# Altium schematic sheet Micron-6.SchDoc: Ультра-Микрон
size A4; Date: 18.11.2013; Author: Andrey Bykanov; CompanyName: http://микрон.net; Engineer: Andrey Bykanov; Address1: Дозиметр Ультра-Микрон; Address2: (с) Быканов Андрей; Address3: Тула, 2014-15г.; Address4: shodan@микрон.net; Revision: 4.06 lite; PageSetup: Record=PageOptions|CenterHorizontal=False|CenterVertical=False|PrintScale=0.98|XCorrection=1.00|YCorrection=1.00|PrintKind=1|BorderSize=5000000|LeftOffset=0|BottomOffset=0|Orientation=2|PaperLength=1000|PaperWidth=1000|Scale=100|PaperSource=7|PrintQuality=-3|MediaType=1|DitherType=10|PrintScaleMode=0|PaperKind=A4|PaperIndex=9
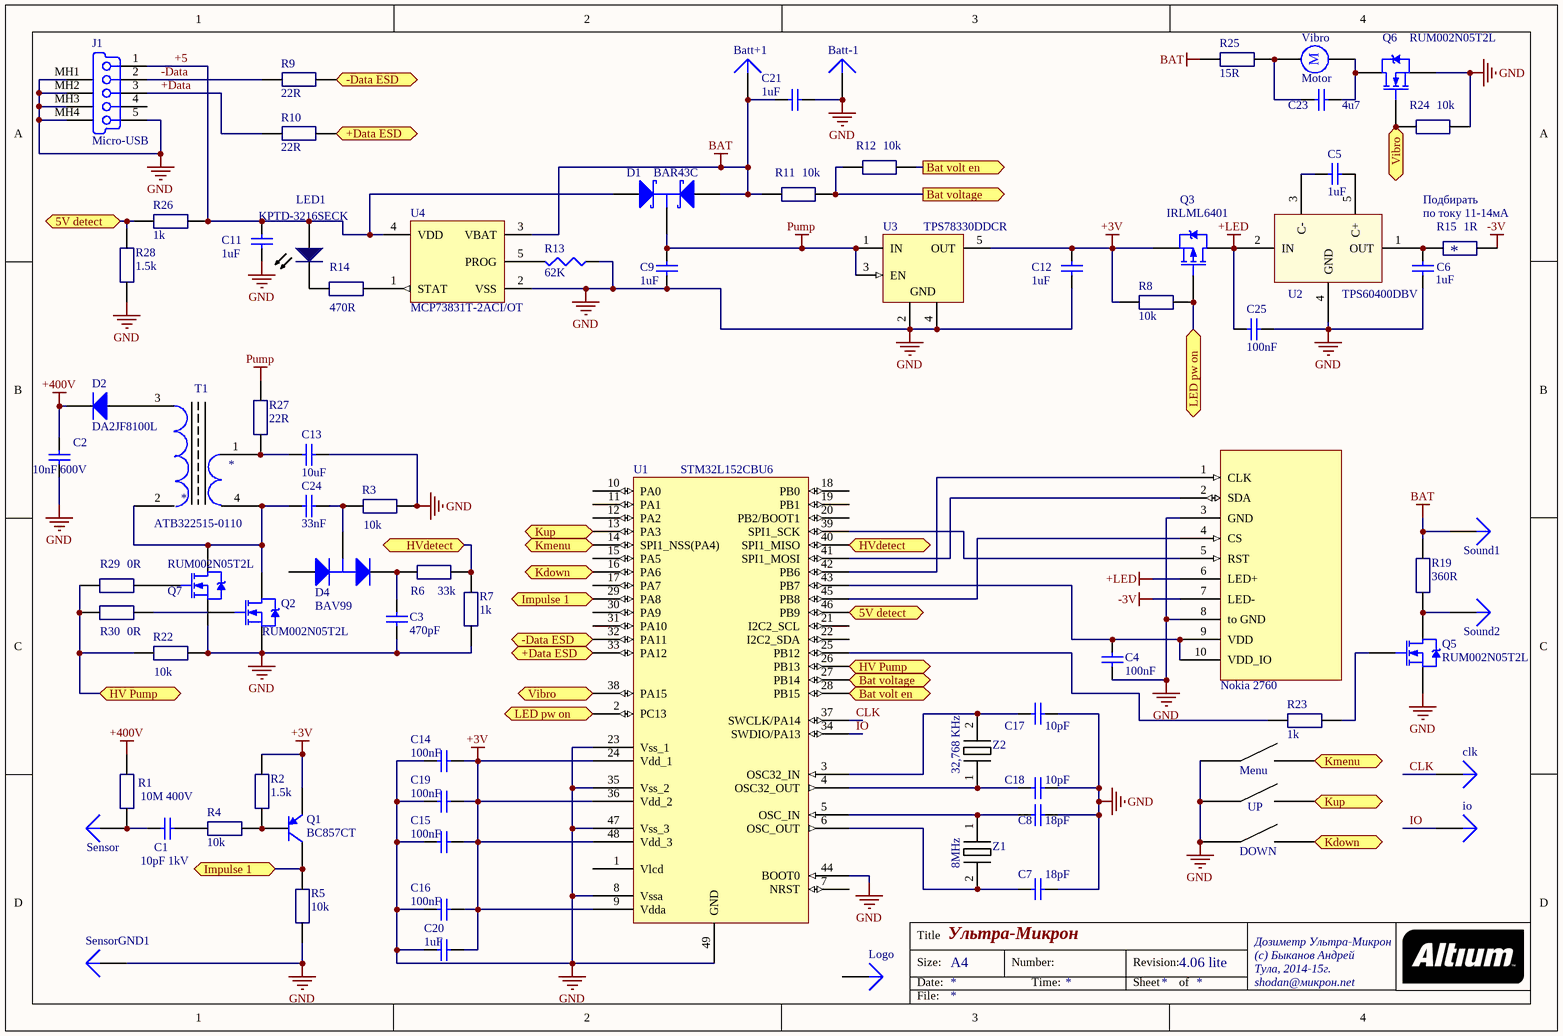
[diagram p0: Micron-6.SchDoc]

## Parts
Batt+1  (no value)  [Sensor contact]
Batt-1  (no value)  [Sensor contact]
C1  10pF 1kV  [0805 sw-2012 std]
C2  10nF 600V  [C1206]
C3  470pF  [1608[0603]]
C4  100nF  [0402 AVX]
C5  1uF  [0402 AVX]
C6  1uF  [0402 AVX]
C7  18pF  [0402 AVX]
C8  18pF  [0402 AVX]
C9  1uF  [1608[0603]]
C11  1uF  [0402 AVX]
C12  1uF  [1608[0603]]
C13  10uF  [C1206]
C14  100nF  [0402 AVX]
C15  100nF  [0402 AVX]
C16  100nF  [0402 AVX]
C17  10pF  [0402 AVX]
C18  10pF  [0402 AVX]
C19  100nF  [0402 AVX]
C20  1uF  [0402 AVX]
C21  1uF  [0402 AVX]
C23  4u7  [C1206]
C24  33nF  [1608[0603]]
C25  100nF  [0402 AVX]
clk  (no value)  [Sensor contact]
D1  BAR43C  [SOT23_N]
D2  DA2JF8100L  [DA2JF8100L]
D4  BAV99  [SOT23-3]
Display1  Nokia 2760  [DF23C-10DS-0.5V]
io  (no value)  [Sensor contact]
J1  Micro-USB  [47346-0001]
KEY1  Menu  [IT-1187-160GM-G]
KEY2  UP  [IT-1187-160GM-G]
KEY3  DOWN  [IT-1187-160GM-G]
LED1  KPTD-3216SECK  [KPTD-3216SECK]
Logo  (no value)  [Logo Micron]
Q1  BC857CT  [SOT416_N]
Q2  RUM002N05T2L  [PMR400UN]
Q3  IRLML6401  [Micro3_N]
Q5  RUM002N05T2L  [PMR400UN]
Q6  RUM002N05T2L  [PMR400UN]
Q7  RUM002N05T2L  [PMR400UN]
R1  10M 400V  [0805 sw-2012 std]
R2  1.5k  [1608[0603]]
R3  10k  [1608[0603]]
R4  10k  [1608[0603]]
R5  10k  [1608[0603]]
R6  33k  [1608[0603]]
R7  1k  [1608[0603]]
R8  10k  [1608[0603]]
R9  22R  [1608[0603]]
R10  22R  [1608[0603]]
R11  10k  [1608[0603]]
R12  10k  [1608[0603]]
R13  62K  [J1-0603]
R14  470R  [1608[0603]]
R15  1R  [1608[0603]]
R19  360R  [Resistor]
R22  10k  [1608[0603]]
R23  1k  [1608[0603]]
R24  10k  [1608[0603]]
R25  15R  [1608[0603]]
R26  1k  [1608[0603]]
R27  22R  [1608[0603]]
R28  1.5k  [1608[0603]]
R29  0R  [1608[0603]]
R30  0R  [1608[0603]]
Sensor  (no value)  [Sensor contact]
SensorGND1  (no value)  [Sensor contact]
Sound1  (no value)  [Sensor contact]
Sound2  (no value)  [Sensor contact]
T1  ATB322515-0110  [ATB322515-0110]
U1  STM32L152CBU6  [UFQFPN48_M]
U2  TPS60400DBV  [SOT-23-OT5_M]
U3  TPS78330DDCR  [TI-DDC5_N]
U4  MCP73831T-2ACI/OT  [SOT-23-OT5_N]
Vibro  Motor  [Vibro 4hobby]
Z1  8MHz  [8MHZ]
Z2  32,768 KHz  [ABS10]

## Ports
5V detect, +Data ESD, +Data ESD (bidir), -Data ESD, -Data ESD (bidir), Bat volt en (out), Bat voltage (out), HV Pump, HVdetect, Impulse 1, Kdown, Kmenu, Kup, LED pw on, Vibro

## Nets
+3V: C12.2 C14.1 C15.1 C16.1 C19.1 C20.1 Q1.2(E) Q3.2(S) R2.1(A) R8.2 U1.9(Vdda) U1.24(Vdd_1) U1.36(Vdd_2) U1.48(Vdd_3) U3.5(OUT)
+400V: C2.2 D2.2(K) R1.2
+LED: C25.1 Display1.6(LED+) Q3.3(D) U2.2(IN)
-3V: Display1.7(LED-) R15.1(A)
BAT: Batt+1.1 C21.2 D1.2(A2) R11.2 R19.1(A) R25.1(A) Sound1.1 U4.3(VBAT)
GND: Batt-1.1 C2.1 C3.2 C4.2 C6.1 C7.1 C8.2 C9.1 C11.1 C12.1 C13.1 C14.2 C15.2 C16.2 C17.1 C18.1 C19.2 C20.2 C21.1 C25.2 Display1.3(GND) Display1.8(to_GND) J1.5(GND) J1.MH1(Tab) J1.MH2(Tab) J1.MH3(Tab) J1.MH4(Tab) KEY1.3 KEY2.3 KEY3.3 Q2.2(S) Q5.2(S) Q6.2(S) Q7.2(S) R3.1(A) R5.2 R7.1(A) R13.1 R22.1(A) R24.1(A) R28.2 SensorGND1.1 U1.8(Vssa) U1.23(Vss_1) U1.35(Vss_2) U1.44(BOOT0) U1.47(Vss_3) U1.49(GND) U2.4(GND) U3.2(GND) U3.4(GND) U4.2(VSS)
Pump: C9.2 D1.3(K) R27.1(A) U3.1(IN) U3.3(EN)
5V detect: R26.1(A) R28.1(A) U1.46(PB9) ; port 5V detect
+5: C11.2 D1.1(A1) J1.1(V_BUS_(5V)) LED1.2 R26.2 U4.4(VDD)
+Data: J1.3(D+) R10.2
+Data ESD: R10.1(A) U1.33(PA12) ; port +Data ESD
-Data: J1.2(D-) R9.2
-Data ESD: R9.1(A) U1.32(PA11) ; port -Data ESD
Bat volt en: R12.1(A) U1.28(PB15) ; port Bat volt en
Bat voltage: R11.1(A) R12.2 U1.27(PB14) ; port Bat voltage
CLK: clk.1 U1.37(SWCLK/PA14)
HV Pump: R22.2 R29.2 R30.2 U1.26(PB13) ; port HV Pump
HVdetect: R6.2 R7.2 U1.40(SPI1_MISO) ; port HVdetect
Impulse 1: Q1.3(C) R5.1(A) U1.29(PA8) ; port Impulse 1
IO: io.1 U1.34(SWDIO/PA13)
Kdown: KEY3.4 U1.16(PA6) ; port Kdown
Kmenu: KEY1.4 U1.14(SPI1_NSS(PA4)) ; port Kmenu
Kup: KEY2.4 U1.13(PA3) ; port Kup
LED pw on: Q3.1(G) R8.1(A) U1.2(PC13) ; port LED pw on
Vibro: Q6.1(G) R24.2 U1.38(PA15) ; port Vibro
NetC1_1: C1.1 R4.1(A)
NetC1_2: C1.2 R1.1(A) Sensor.1
NetC3_1: C3.1 D4.2(K) R6.1(A)
NetC4_1: C4.1 Display1.9(VDD) Display1.10(VDD_IO) U1.43(PB7)
NetC5_1: C5.1 U2.5(C+)
NetC5_2: C5.2 U2.3(C-)
NetC6_2: C6.2 R15.2 U2.1(OUT)
NetC7_2: C7.2 U1.6(OSC_OUT) Z1.2
NetC8_1: C8.1 U1.5(OSC_IN) Z1.1
NetC13_2: C13.2 R27.2 T1.1
NetC17_2: C17.2 U1.3(OSC32_IN) Z2.2
NetC18_2: C18.2 U1.4(OSC32_OUT) Z2.1
NetC23_1: C23.1 Q6.3(D) Vibro.2
NetC23_2: C23.2 R25.2 Vibro.1
NetC24_1: C24.1 Q2.3(D) Q7.3(D) T1.2 T1.4
NetC24_2: C24.2 D4.3(C) R3.2
NetD2_1: D2.1(A) T1.3
NetDisplay1_1: Display1.1(CLK) U1.42(PB6)
NetDisplay1_2: Display1.2(SDA) U1.41(SPI1_MOSI)
NetDisplay1_4: Display1.4(CS) U1.45(PB8)
NetDisplay1_5: Display1.5(RST) U1.39(SPI1_SCK)
NetLED1_1: LED1.1 R14.2
NetQ1_1: Q1.1(B) R2.2 R4.2
NetQ2_1: Q2.1(G) R30.1(A)
NetQ5_1: Q5.1(G) R23.1(A)
NetQ5_3: Q5.3(D) R19.2 Sound2.1
NetQ7_1: Q7.1(G) R29.1(A)
NetR13_2: R13.2 U4.5(PROG)
NetR14_1: R14.1(A) U4.1(STAT)
NetR23_2: R23.2 U1.25(PB12)

Not connected (* = marked no-connect by the designer): D4 1(A); J1 4(NC); Logo 1; U1 1(Vlcd) 7(NRST) 10(PA0) 11(PA1) 12(PA2) 15(PA5) 17(PA7) 18(PB0) 19(PB1) 20(PB2/BOOT1) 21(I2C2_SCL) 22(I2C2_SDA) 30(PA9) 31(PA10)

## Notes on the sheet
- Подбирать
- по току 11-14мА
- (near R15) *
- Title
- Size:
- Date:
- A4
- Number:
- Time:
- Revision:
- Sheet
- of
- File:
- (in symbol Motor) M

## Library data of the parts
Batt+1 = Plug: Order: EEMB LP401230; LatestRevisionDate: 17-Jul-2002; LatestRevisionNote: Re-released for DXP Platform.; Publisher: Altium Limited
Batt-1 clk io Logo SensorGND1 Sound2 = Plug: LatestRevisionDate: 17-Jul-2002; LatestRevisionNote: Re-released for DXP Platform.; Publisher: Altium Limited
C1 = Cap Semi: Capacitor (Semiconductor SIM Model); Order: VJ0805A100JXGAT5Z; Published: 8-Jun-2000; LatestRevisionDate: 29-May-2009; LatestRevisionNote: IPC-7351 Footprint Added.; PackageReference: C0805; Publisher: Altium Limited; PackageDescription: Chip Capacitor; Value: 10pF 1kV
C2 = Cap Semi: Capacitor (Semiconductor SIM Model); Order: 1206CC103KAT1A; Published: 8-Jun-2000; LatestRevisionDate: 29-May-2009; LatestRevisionNote: IPC-7351 Footprint Added.; PackageReference: C1206; Publisher: Altium Limited; PackageDescription: Chip Capacitor; Value: 10nF 600V
C3 = Cap Semi: Capacitor (Semiconductor SIM Model); Order: CC0603JRNPO9BN471; Value: 470pF
C4 C14-C16 C19 C25 = Cap Semi: Capacitor (Semiconductor SIM Model); Order: 0402ZD104KAT2A; Published: 8-Jun-2000; LatestRevisionDate: 29-May-2009; LatestRevisionNote: IPC-7351 Footprint Added.; PackageReference: C1206; Publisher: Altium Limited; PackageDescription: Chip Capacitor; Value: 100nF
C5 C6 C11 C20 = Cap Semi: Capacitor (Semiconductor SIM Model); Order: CC0402KRX5R5BB105; Avail: 1; Published: 8-Jun-2000; LatestRevisionDate: 29-May-2009; LatestRevisionNote: IPC-7351 Footprint Added.; PackageReference: C1206; Publisher: Altium Limited; PackageDescription: Chip Capacitor; Value: 1uF
C7 C8 = Cap Semi: Capacitor (Semiconductor SIM Model); Order: GRM1555C1H180JZ01D; Published: 8-Jun-2000; LatestRevisionDate: 29-May-2009; LatestRevisionNote: IPC-7351 Footprint Added.; PackageReference: C1206; Publisher: Altium Limited; PackageDescription: Chip Capacitor; Value: 18pF
C9 = CAPACITOR: Capacitor (Semiconductor SIM Model); Order: CC0603KRX5R7BB105; Avail: 1; Published: 8-Jun-2000; LatestRevisionDate: 29-May-2009; LatestRevisionNote: IPC-7351 Footprint Added.; PackageReference: C1206; Publisher: Altium Limited; PackageDescription: Chip Capacitor; Value: 1uF
C12 = CAPACITOR: Capacitor (Semiconductor SIM Model); Order: CC0603KRX5R7BB105; Published: 8-Jun-2000; LatestRevisionDate: 29-May-2009; LatestRevisionNote: IPC-7351 Footprint Added.; PackageReference: C1206; Publisher: Altium Limited; PackageDescription: Chip Capacitor; Value: 1uF
C13 = Cap Semi: Capacitor (Semiconductor SIM Model); Order: GRM31CR61A106KA01L; Published: 8-Jun-2000; LatestRevisionDate: 29-May-2009; LatestRevisionNote: IPC-7351 Footprint Added.; PackageReference: C1206; Publisher: Altium Limited; PackageDescription: Chip Capacitor; Value: 10uF
C17 C18 = Cap Semi: Capacitor (Semiconductor SIM Model); Order: GRM1555C1H100JA01D; Published: 8-Jun-2000; LatestRevisionDate: 29-May-2009; LatestRevisionNote: IPC-7351 Footprint Added.; PackageReference: C1206; Publisher: Altium Limited; PackageDescription: Chip Capacitor; Value: 10pF
C21 = Cap Semi: Capacitor (Semiconductor SIM Model); Order: CC0402KRX5R5BB105; Published: 8-Jun-2000; LatestRevisionDate: 29-May-2009; LatestRevisionNote: IPC-7351 Footprint Added.; PackageReference: C1206; Publisher: Altium Limited; PackageDescription: Chip Capacitor; Value: 1uF
C23 = CAPACITOR: Capacitor (Semiconductor SIM Model); Order: CC1206KKX7R8BB475; Avail: 1; Published: 8-Jun-2000; LatestRevisionDate: 29-May-2009; LatestRevisionNote: IPC-7351 Footprint Added.; PackageReference: C1206; Publisher: Altium Limited; PackageDescription: Chip Capacitor; Value: 4u7
C24 = Cap Semi: Capacitor (Semiconductor SIM Model); Order: 06035C333JAT2A; Value: 33nF
D1 = BAT54C: Schottky Barrier Double Diode; Published: 17-Sep-2003; LatestRevisionDate: 12-Dec-2006; LatestRevisionNote: IPC-7351 Footprint Added.; DatasheetVersion: 4-Mar-2002; PackageVersion: May-1999; PackageReference: SOT23; Publisher: Altium Limited; PackageDescription: 3-Pin SOT-23 Package 0.95 mm Pitch, 2.3 mm Lead Span; ComponentLink1Description: Manufacturer Link; ComponentLink1URL: http://www.semiconductors.philips.com/; ComponentLink2Description: Datasheet; ComponentLink2URL: http://www.semiconductors.philips.com/acrobat/datasheets/BAT54_SERIES_4.pdf; Order: BAR43C
D2 = Diode: Default Diode; Published: 8-Jun-2000; LatestRevisionDate: 17-Jul-2002; LatestRevisionNote: Re-released for DXP Platform.; PackageVersion: Sep-1996; PackageReference: SMC; Publisher: Altium Limited; PackageDescription: DO-214-AB/SMC; 2 C-Bend Leads; Body 7.9 x 5.9 mm, inc. leads (LxW); Code_JEDEC: DO-214-AB; Order: DA2JF8100L; Value: DA2JF8100L
D4 = BAV99: Silicon Switching Diode Array for High-Speed Switching; Published: 21-Mar-2003; DatasheetDocument: Oct-1999; PackageDocument: Sep-2001; PackageReference: SOT-23; Publisher: Altium Limited; ComponentLink1Description: Manufacturer Link; ComponentLink1URL: http://www.infineon.com/; ComponentLink2Description: Datasheet; ComponentLink2URL: http://www.infineon.com/upload/Document/cmc_upload/documents/080/631/bav99series_1.pdf; Value: BAV99; Order: BAV99
Display1 = Nokia 2760: Order: Nokia 2760 ext + Socket Hirose DF23C-10DS-0.5V
J1 = 0481900001: USB On-The-Go (OTG) Mini-B Receptacle, Right Angle, SMT, 0.80mm (.031") Pitch, Solder Tabs with Back Cover, Recessed Type; Order: Molex 47346-0001
KEY1-KEY3 = Micro_key_smd: Order: IT-1187-160GM-G
LED1 = KPTD-3216SECK: Avail: 1; Order: KPTD-3216SECK
Q1 = BC857CT: PNP General-purpose Transistor; Published: 17-Sep-2003; LatestRevisionDate: 12-Dec-2006; LatestRevisionNote: IPC-7351 Footprint Added.; DatasheetVersion: 15-Nov-2000; PackageVersion: Apr-1999; PackageReference: SOT416; Publisher: Altium Limited; PackageDescription: 3-Pin SOT-416 Package 0.50 mm Pitch, 1.6 mm Lead Span; Code_JEITA: SC-75; ComponentLink1Description: Manufacturer Link; ComponentLink1URL: http://www.semiconductors.philips.com/; ComponentLink2Description: Datasheet; ComponentLink2URL: http://www.semiconductors.philips.com/acrobat/datasheets/BC856T_857T_SERIES_3.pdf; value: BC857CT; order: BC857CT
Q2 Q5-Q7 = IRLML2402: HEXFET Power MOSFET; Published: 8-Jun-2000; LatestRevisionDate: 20-Nov-2009; LatestRevisionNote: IPC-7351 Footprint Added.; DatasheetVersion: Aug-1997; PackageReference: SOT-23; Publisher: Altium Limited; PackageDescription: 3-Pin SOT-23 Package 0.95 mm Pitch, 2.3 mm Lead Span; ComponentLink1Description: Manufacturer Link; ComponentLink1URL: http://www.irf.com/; ComponentLink2Description: Datasheet; ComponentLink2URL: http://www.irf.com/product-info/datasheets/data/irlml2402.pdf; Order: RUM002N05T2L; Value: RUM002N05T2L
Q3 = IRLML6401: HEXFET Power MOSFET; Published: 17-Sep-2003; DatasheetVersion: 2-Jul-2001; PackageVersion: Jul-2001; PackageReference: Micro3; Publisher: Altium Limited; PackageDescription: 3-Pin SOT-23 Package 0.95 mm Pitch, 2.3 mm Lead Span; ComponentLink1Description: Manufacturer Link; ComponentLink1URL: http://www.irf.com/; ComponentLink2Description: Datasheet; ComponentLink2URL: http://www.irf.com/product-info/datasheets/data/IRLML6401.pdf; Order: IRLML6401; Value: IRLML6401
R1 = Resistor 0805: Model: RCV080510M0FKEA; Order: RCV080510M0FKEA; Value: 10M 400V
R2 R28 = Resistor 0805: Order: RC0603FR-071K5L; Value: 1.5k
R3 R5 R8 R22 R24 = Resistor 0805: Order: RC0603FR-1010KL; Value: 10k
R4 R11 R12 = Resistor 0805: Order: RC0603FR-1010KL; Avail: 1; Value: 10k
R6 = Resistor 0805: Order: RC0603FR-0733KL; Value: 33k
R7 R23 = Resistor 0805: Order: RC0603FR-101KL; Value: 1k
R9 R10 R27 = Resistor 0805: Order: CR0603-JW-220GLF; Avail: 20; Value: 22R
R13 = Res3: Resistor; Order: RC0603JR-0762KL; Avail: 1; Published: 8-Jun-2000; LatestRevisionDate: 29-May-2009; LatestRevisionNote: IPC-7351 Footprint Added.; PackageReference: J1-0603; Publisher: Altium Limited; PackageDescription: Chip Resistor; Value: 62K
R14 = Resistor 0805: Order: RC0603JR-07470RL; Avail: 1; Value: 470R
R15 = Resistor 0805: Order: RC0603FR-071RL; Avail: 20; Value: 1R
R19 = Resistor 0805: Order: RC0805FR-07360RL; Value: 360R
R25 = Resistor 0805: Order: RC0805FR-0715RL; Value: 15R
R26 = Resistor 0805: Order: RC0603FR-101KL; Avail: 1; Value: 1k
R29 R30 = Resistor 0805: Order: RC0603JR-100RL; Value: 0R
Sensor = Plug: Order: SBM-10; LatestRevisionDate: 17-Jul-2002; LatestRevisionNote: Re-released for DXP Platform.; Publisher: Altium Limited
Sound1 = Plug: Order: 7BB-12-9; LatestRevisionDate: 17-Jul-2002; LatestRevisionNote: Re-released for DXP Platform.; Publisher: Altium Limited
T1 = ATB322515-0110: Value: FlayBack trans.; Order: ATB322515-0110
U2 = TPS60400: Order: TPS60400DBV
U3 = TPS78330DDCR: Single Output LDO, 150 mA, Fixed 3 V Output, 2.2 to 5.5 V Input, with Ultra-Low IQ, 5-pin SOT (DDC), -40 to 105 degC, Green (RoHS & no Sb/Br); Manufacturer: Texas Instruments; Accuracy(%): 3; Iout(Max)(A): 0.15; Iq(Typ)(mA): 0.0005; Rating: Catalog; SubFamily: Single Channel LDO; Vdo(Typ)(mV): 130; Vin(Max)(V): 5.5; Vin(Min)(V): 2.2; DatasheetVersion: SBVS133; PackageVersion: 4204403-2/E; PackageReference: DDC5; PackageDescription: 5-Pin Plastic Small Outline, Body 2.9 x 1.6 mm, 0.95 mm Pitch; Supplier 1: Digi-Key; Supplier Part Number 1: 296-25880-2-ND; Supplier 2: Digi-Key; Supplier Part Number 2: 296-25880-1-ND; Supplier 3: Digi-Key; Supplier Part Number 3: 296-25880-6-ND; Supplier 4: Newark; Supplier Part Number 4: 72R6681; Supplier 5: Mouser; Supplier Part Number 5: 595-TPS78330DDCR; Eco-Plan: Green (RoHS & no Sb/Br); Fixed Output Options(V): 3; Vout Adj(Max)(V): 3; Vout Adj(Min)(V): 3; Mounting Technology: Surface Mount; Code_JEDEC: MO-193; PartNumber: TPS78330DDCR; ComponentLink1Description: Manufacturer URL; ComponentLink1URL: http://www.ti.com/; ComponentLink2Description: Datasheet; ComponentLink2URL: http://www.ti.com/general/docs/lit/getliterature.tsp?genericPartNumber=TPS78330&fileType=pdf; ComponentLink3Description: Package Specification; ComponentLink3URL: http://www.ti.com/litv/pdf/mpds123d; Order: TPS78330DDCR
U4 = MCP73831T-2ACI/OT: Miniature Single-Cell, Fully Integrated Li-Ion, Li-Polymer Charge Management Controller, 4.2V, 5-Pin SOT-23, Industrial Temperature, Tape and Reel; Avail: 1; Published: 29-Jan-2009; LatestRevisionDate: 27-Nov-2009; LatestRevisionNote: Updated to datasheet revision E, Sep-2008; DatasheetVersion: revE, Sep-2008; PackageVersion: revBB, Aug-2009; PackageReference: SOT-23-OT5; Publisher: Altium Limited; PackageDescription: 5-Lead Plastic Small Outline Transistor (OT) [SOT-23]; Supplier 1: Digi-Key; Supplier Part Number 1: MCP73831T-2ACI/OTTR-ND; Supplier 2: Digi-Key; Supplier Part Number 2: MCP73831T-2ACI/OTCT-ND; Supplier 3: Digi-Key; Supplier Part Number 3: MCP73831T-2ACI/OTDKR-ND; Supplier 4: Farnell; Supplier Part Number 4: 1332158; Code_IPC: SOT23-5; ComponentLink1Description: Datasheet; ComponentLink1URL: http://ww1.microchip.com/downloads/en/DeviceDoc/21984e.pdf; ComponentLink2Description: Packaging Specification; ComponentLink2URL: http://www.microchip.com/stellent/groups/techpub_sg/documents/packagingspec/en012702.pdf; ComponentLink3Description: Microchip.com Home; ComponentLink3URL: http://www.microchip.com/; Order: MCP73831T-2ACI/OT
Vibro = Motor: Motor, General Kind; Order: Vibro from EBAY 4HOBBY; Value: Vibro from EBAY 4HOBBY; Published: 24-Mar-1999; LatestRevisionDate: 17-Jul-2002; LatestRevisionNote: Re-released for DXP Platform.; PackageReference: RB5-10.5; Publisher: Altium Limited; PackageDescription: Capacitor (Radial); 2 Leads
Z1 = 8MHZ: Order: ABM7-8.000MHZ-D2Y-T; Value: 8MHz
Z2 = 8MHZ: Order: ABS10-32.768KHZ-7-T; Value: 32,768 KHz
U1 = STM32L152CBU6: Order: STM32L152CBU6